# EAGLE design dip-switch-daughter-brd-revA (EAGLE 9.6.2)
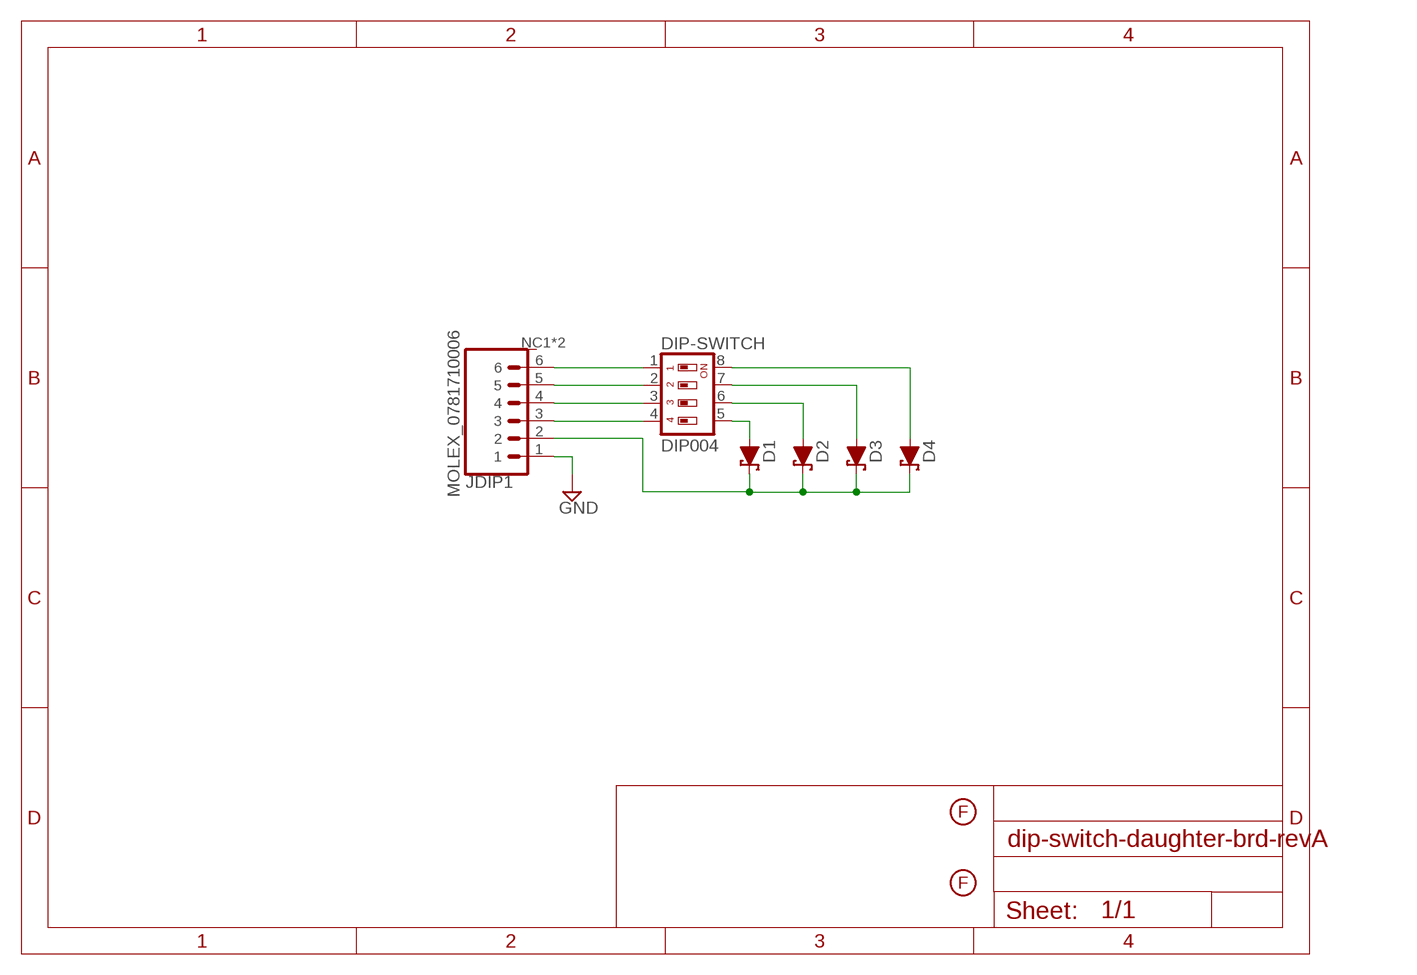
[diagram p0: schematic, sheet 1]

## Parts
D1  1N5819WS  [SOD-123]
D2  1N5819WS  [SOD-123]
D3  1N5819WS  [SOD-123]
D4  1N5819WS  [SOD-123]
DIP-SWITCH  DIP004  [DIP-1.27-004]
F1  FIDUCIAL  [FIDUCIAL]
F2  FIDUCIAL  [FIDUCIAL]
JDIP1  MOLEX_0781710006  [MOLEX_781710006]

## Nets
COL3: DIP-SWITCH.4 JDIP1.3
COL4: DIP-SWITCH.3 JDIP1.4
COL6: DIP-SWITCH.2 JDIP1.5
COL7: DIP-SWITCH.1 JDIP1.6
GND: JDIP1.1
N$5: D1.A DIP-SWITCH.5
N$6: D2.A DIP-SWITCH.6
N$7: D3.A DIP-SWITCH.7
N$8: D4.A DIP-SWITCH.8
ROW5: D1.C D2.C D3.C D4.C JDIP1.2
Unconnected: JDIP1.NC1(M) JDIP1.NC2(M)

## Library data of the parts
D1-D4 = jlcpcb_basic_parts:1N5819WS: JLCPCB Part # C8598 Description 40V 600mV@1A 1A SOD-123 Schottky Barrier Diodes (SBD) ROHS Schottky Diode
DIP-SWITCH = untitled:DIP004
F1 F2 = __temp_to_delete:FIDUCIAL
JDIP1 = molex-pico-ezmate:MOLEX_0781710006

## Board
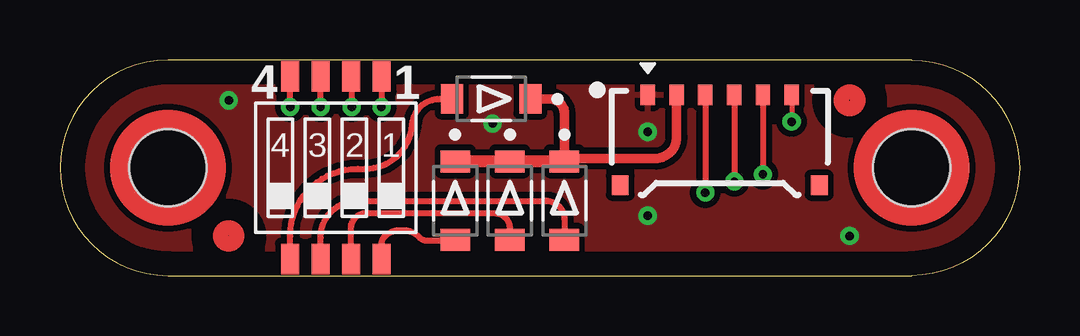
[diagram p1: board, top side]
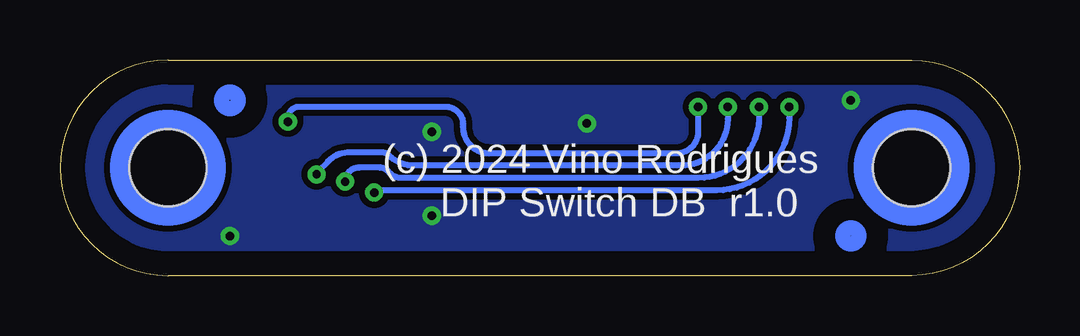
[diagram p2: board, bottom side, seen from below]

Size 40 x 9 mm. Coordinates in mm from the lower left corner, seen from the top.
Outline: 4.5,0 35.5,0 arc180 35.5,9 4.5,9 arc180 4.5,0
Copper layers (1*16): Top 0.035mm / dielectric 1.5mm / Bottom 0.035mm
Design rules "default *": minimum track width 6mil, minimum drill 0.35mm, track to track 10mil, track to pad 20mil, pad to pad 10mil, via to via 10mil, smd to smd 10mil, copper to edge 40mil, drill to drill 6mil, minimum pad ring 10mil, minimum via ring 8mil, stop-mask expansion 4mil, vias tented up to drill 0mil, thermal gap 10mil
Holes 3.2 mm at 4.5,4.5 35.5,4.5

### Footprints (pad centres in the part's own frame; a part is rotated, then mirrored left to right if it is on the bottom)
SOD-123 = smd 0.914 x 1.219: A 1.638,0; C -1.638,0
DIP-1.27-004 = smd 0.76 x 1.27: 1 -1.905,-3.81; 2 -0.635,-3.81; 3 0.635,-3.81; 4 1.905,-3.81; 5 1.905,3.81; 6 0.635,3.81; 7 -0.635,3.81; 8 -1.905,3.81
MOLEX_781710006 = smd 0.6 x 0.85: 1 -3,2; 2 -1.8,2; 3 -0.6,2; 4 0.6,2; 5 1.8,2; 6 3,2 | smd 0.7 x 0.8: NC1 -4.15,-1.775; NC2 4.15,-1.775

### Placement (x,y rotation side)
D1  17.98,7.38 180 top
D2  21.02,3.12 270 top
D3  18.75,3.12 270 top
D4  16.48,3.12 270 top
DIP-SWITCH  11.5,4.5 180 top
F1  7.04,1.65 0 top
F2  32.92,7.32 0 top
JDIP1  27.5,5.55 0 top

### Tracks (layer width: path | path; a pad name or v marks a point on that pad's centre or on a via)
COL3  (via drill 0.35)
  Top 0.2: DIP-SWITCH.4
  Top 0.254: v9.6,7.04 DIP-SWITCH.4 | JDIP1.3 v26.9,3.46
  Bottom 0.254: v9.6,7.04 9.6,6.59 arc90 12.63,3.56 26.67,3.56 arc-45 v26.9,3.46
COL4  (via drill 0.35)
  Top 0.2: DIP-SWITCH.3 10.85,8.3 | JDIP1.4 28.11,7.54
  Top 0.254: v10.86,7.04 10.85,8.3 | 28.11,7.54 v28.11,3.92
  Bottom 0.254: v10.86,7.04 10.86,6.6 arc90 13.39,4.07 25.78,4.07 arc45 26.23,4.26 26.35,4.38 arc-45 26.66,4.51 27.53,4.51 arc-90 v28.11,3.92
COL6  (via drill 0.35)
  Top 0.2: DIP-SWITCH.2 12.17,8.27
  Top 0.254: 12.17,8.27 v12.16,7.04 | JDIP1.5 v29.3,4.22
  Bottom 0.254: v12.16,7.04 12.16,6.54 arc90 14.12,4.59 25.25,4.59 arc45 26.29,5.02 arc-45 26.6,5.14 27.91,5.14 arc-45 28.83,4.76 29.25,4.34 arc-45 v29.3,4.22
COL7  (via drill 0.35)
  Top 0.2: JDIP1.6 v30.5,6.42 | DIP-SWITCH.1
  Top 0.254: DIP-SWITCH.1 v13.4,7.04
  Bottom 0.254: v13.4,7.04 13.4,6 arc90 14.3,5.1 22.09,5.1 arc90 23.2,6.21 23.2,6.31 arc-90 23.94,7.05 30.01,7.05 arc-90 30.5,6.56 v30.5,6.42
GND  (via drill 0.35)
  other vias: 24.5,6 7.04,7.32 24.5,2.5 32.92,1.65 18.03,6.35
  pour Top (isolate 0.254): 3,9 0,6 0,3 3,0 37,0 40,3 40,6 37,9
  pour Bottom (isolate 0.254): 37,9 40,6 40,3 37,0 3,0 0,3 0,6 3,9
N$5
  Top 0.254: DIP-SWITCH.5 9.6,1.65 arc-90 12.41,4.46 12.71,4.46 arc90 14.69,6.44 14.69,6.24 arc-90 15.82,7.38 D1.A
N$6
  Top 0.254: DIP-SWITCH.6 10.87,1.59 arc-90 12.4,3.12 20.26,3.12 arc-90 21.02,2.35 D2.A
N$7
  Top 0.254: DIP-SWITCH.7 12.13,1.98 arc-90 12.77,2.61 18.12,2.61 arc-90 18.75,1.98 D3.A
N$8
  Top 0.254: DIP-SWITCH.8 13.4,1.33 arc-45 13.53,1.62 arc-45 14.2,1.91 14.29,1.91 arc-45 14.94,1.64 14.98,1.59 arc45 15.3,1.46 16.41,1.46 arc45 D4.A
ROW5
  Top 0.4: JDIP1.2 25.7,5.76 arc-90 24.83,4.89 21.15,4.89 D2.C 21.02,6.76 arc90 20.41,7.38 D1.C
  Top 0.5: D2.C D3.C D4.C
(copper drawn outside any net)
  shapes: Bottom circle x2, Top circle x2

### Text on the board
tPlace: 4 | 1
bPlace: (c) 2024 Vino Rodrigues / DIP Switch DB r1.0